# Altium schematic sheet ADC.SchDoc: Dual Wireless Mic TX
size A4; DrawnBy: ANOL; Revision: 1.0; SheetNumber: 2; SheetTotal: 3
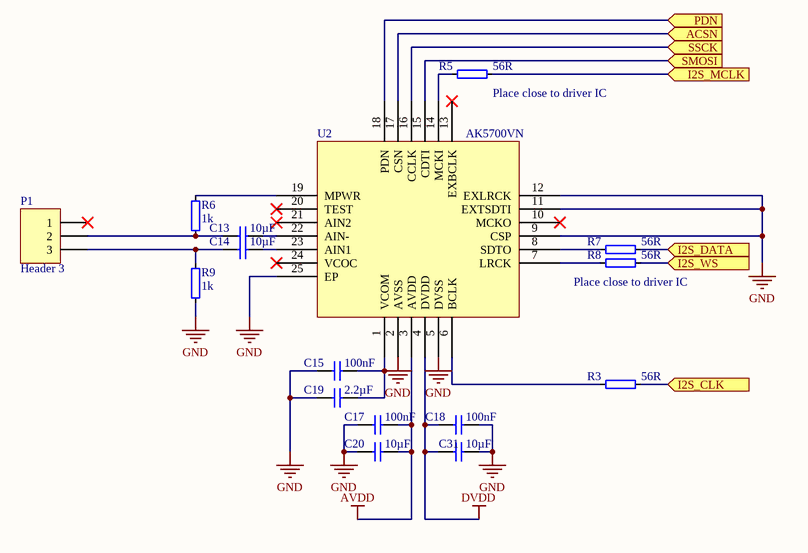
[diagram p0: ADC.SchDoc]

## Parts
C13  10µF  [0805]
C14  10µF  [0805]
C15  100nF  [0402s]
C17  100nF  [0402s]
C18  100nF  [0402s]
C19  2.2µF  [0603s]
C20  10µF  [0603s]
C31  10µF  [0603s]
P1  Header 3  [Headphone]
R3  56R  [0402s]
R5  56R  [0402s]
R6  1k  [0402s]
R7  56R  [0402s]
R8  56R  [0402s]
R9  1k  [0402s]
U2  AK5700VN  [QFN50P400X400X80-24N]

## Ports
ACSN (in), I2S_CLK (in), I2S_DATA (in), I2S_MCLK (in), I2S_WS (in), PDN (in), SMOSI (in), SSCK (in)

## Nets
AVDD: C17.2 C20.2 U2.3(AVDD)
DVDD: C18.1 C31.1 U2.4(DVDD)
GND: C15.1 C17.1 C18.2 C19.1 C20.1 C31.2 R9.1 U2.2(AVSS) U2.5(DVSS) U2.9(CSP) U2.11(EXTSDTI) U2.12(EXLRCK) U2.25(EP)
ACSN: U2.17(CSN) ; port ACSN
I2S_CLK: R3.2 ; port I2S_CLK
I2S_DATA: R7.2 ; port I2S_DATA
I2S_MCLK: R5.2 ; port I2S_MCLK
I2S_WS: R8.2 ; port I2S_WS
PDN: U2.18(PDN) ; port PDN
SMOSI: U2.15(CDTI) ; port SMOSI
SSCK: U2.16(CCLK) ; port SSCK
NetC13_1: C13.1 P1.2 R6.1
NetC13_2: C13.2 U2.22(AIN-)
NetC14_1: C14.1 P1.3 R9.2
NetC14_2: C14.2 U2.23(AIN1)
NetC15_2: C15.2 C19.2 U2.1(VCOM)
NetR3_1: R3.1 U2.6(BCLK)
NetR5_1: R5.1 U2.14(MCKI)
NetR6_2: R6.2 U2.19(MPWR)
NetR7_1: R7.1 U2.8(SDTO)
NetR8_1: R8.1 U2.7(LRCK)

Not connected (* = marked no-connect by the designer): P1 1*; U2 10(MCKO)* 13(EXBCLK)* 20(TEST)* 21(AIN2)* 24(VCOC)*

## Notes on the sheet
- (near R5) Place close to driver IC
- (near R8) Place close to driver IC

## Library data of the parts
C13 C14 = C0805-10µ: Chip Cap 0805; Note: Chip Cap 10%; Artikkelnr Noca: 20039243; Part Number: C0805-10µ; Manufacturer: *; Manufacturer Part Number: *; Datasheet: *; LatestRevisionDate: 2010-06-03; Pin Count: 2; Publisher: Nordic Semiconductor; Published: 2010-06-03; Value: 10µF; Supplier: *; Supplier part number: *; 2nd source Supplier: *; 2nd source part number: *
C15 C17 C18 = C0402-100n: Chip Cap 0402; Note: Chip Cap 10%; Artikkelnr Noca: 20039200; Part Number: C0402-100n; Manufacturer: *; Manufacturer Part Number: *; Datasheet: *; LatestRevisionDate: 2009-11-23; Pin Count: 2; Publisher: Nordic Semiconductor; Published: 2009-05-08; Value: 100nF; Supplier: *; Supplier part number: *; 2nd source Supplier: *; 2nd source part number: *
C19 = C0603-2µ2: Chip Cap 0603; Note: Chip Cap 1%; Artikkelnr Noca: N.A.; Part Number: C0603-2µ2; Manufacturer: *; Manufacturer Part Number: *; Datasheet: *; LatestRevisionDate: 2009-05-08; Pin Count: 2; Publisher: Nordic Semiconductor; Published: 2009-05-08; Value: 2.2µF; Supplier: *; Supplier part number: *; 2nd source Supplier: *; 2nd source part number: *
C20 C31 = C0603-10µ: Chip Cap 0603; Note: Chip Cap 10%; Artikkelnr Noca: 20039252; Part Number: C0603-10µ; Manufacturer: *; Manufacturer Part Number: *; Datasheet: *; LatestRevisionDate: 2011-01-17; Pin Count: 2; Publisher: Nordic Semiconductor; Published: 2011-01-17; Value: 10µF; Supplier: *; Supplier part number: *; 2nd source Supplier: *; 2nd source part number: *
P1 = Header 3: Header, 3-Pin; LatestRevisionDate: 17-Jul-2002; LatestRevisionNote: Re-released for DXP Platform.; Publisher: Altium Limited
R3 R5 R7 R8 = R0402-56R: Chip Res 0402; Note: Chip Res 1%; Artikkelnr Noca: 27049043; Part Number: R0402-56R; Manufacturer: *; Manufacturer Part Number: *; Datasheet: *; Footprint: 0402; LatestRevisionDate: 2009-11-23; Pin Count: 2; Publisher: Nordic Semiconductor; Published: 2009-05-08; Value: 56R; Supplier: *; Supplier part number: *; 2nd source Supplier: *; 2nd source part number: *
R6 R9 = R0402-1k0: Chip Res 0402; Note: Chip Res 1%; Artikkelnr Noca: 27049073; Part Number: R0402-1k0; Manufacturer: *; Manufacturer Part Number: *; Datasheet: *; Footprint: 0402; LatestRevisionDate: 2009-11-23; Pin Count: 2; Publisher: Nordic Semiconductor; Published: 2009-05-08; Value: 1k; Supplier: *; Supplier part number: *; 2nd source Supplier: *; 2nd source part number: *